# Altium schematic sheet GIT_TEST.SchDoc
size A4; Date: 2026-05-19; Author: cocacus@gmail.com; SheetNumber: 1; SheetTotal: 1; Time: GIT TEST
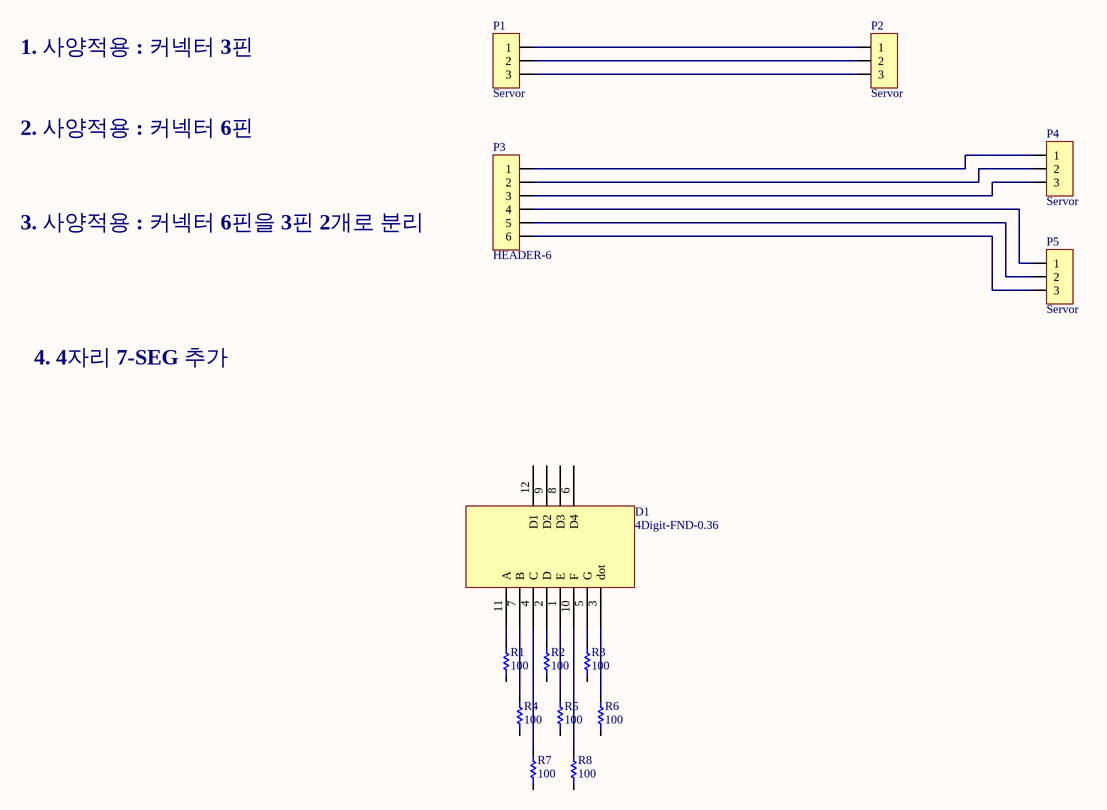
[diagram p0: GIT_TEST.SchDoc]

## Parts
D1  4Digit-FND-0.36  [4Digit-FND-0.36]
P1  Servor  [PIN3]
P2  Servor  [PIN3]
P3  HEADER-6  [PIN6]
P4  Servor  [PIN3]
P5  Servor  [PIN3]
R1  100  [0603R1608]
R2  100  [0603R1608]
R3  100  [0603R1608]
R4  100  [0603R1608]
R5  100  [0603R1608]
R6  100  [0603R1608]
R7  100  [0603R1608]
R8  100  [0603R1608]

## Nets
NetD1_1: D1.1(E) R5.2
NetD1_2: D1.2(D) R2.2
NetD1_3: D1.3(dot) R6.2
NetD1_4: D1.4(C) R7.2
NetD1_5: D1.5(G) R3.2
NetD1_7: D1.7(B) R4.2
NetD1_10: D1.10(F) R8.2
NetD1_11: D1.11(A) R1.2
NetP1_1: P1.1 P2.1
NetP1_2: P1.2 P2.2
NetP1_3: P1.3 P2.3
NetP3_1: P3.1 P4.1
NetP3_2: P3.2 P4.2
NetP3_3: P3.3 P4.3
NetP3_4: P3.4 P5.1
NetP3_5: P3.5 P5.2
NetP3_6: P3.6 P5.3

Not connected (* = marked no-connect by the designer): D1 6(D4) 8(D3) 9(D2) 12(D1); R1 1; R2 1; R3 1; R4 1; R5 1; R6 1; R7 1; R8 1

## Notes on the sheet
- 1. 사양적용 : 커넥터 3핀
- 2. 사양적용 : 커넥터 6핀
- 3. 사양적용 : 커넥터 6핀을 3핀 2개로 분리
- 4. 4자리 7-SEG 추가

## Library data of the parts
P1 P2 P4 P5 = HEADER-3: Connector
P3 = HEADER-6: Connector
R1-R8 = Res1_1: Resistor; Published: 8-Jun-2000; LatestRevisionDate: 17-Jul-2002; LatestRevisionNote: Re-released for DXP Platform.; PackageReference: AXIAL-0.3; Publisher: Altium Limited; PackageDescription: Axial Device, Thru-Hole; 2 Leads; 0.3 in Pin Spacing